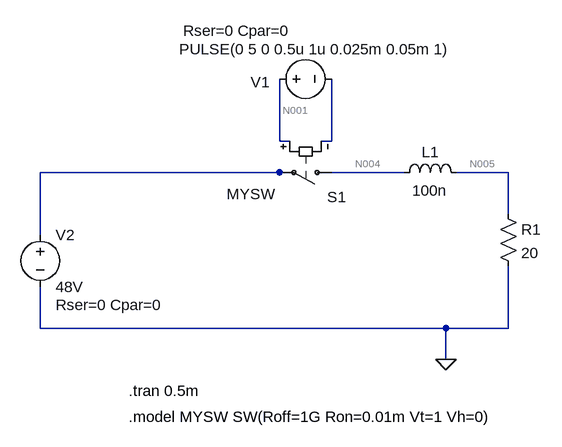
[diagram p0: schematic sim_caps.asc]
sim_caps.asc, the LTspice schematic file:
Version 4
SHEET 1 1212 680
WIRE 128 176 128 80
WIRE 144 176 128 176
WIRE 208 176 208 80
WIRE 208 176 192 176
WIRE 128 224 -240 224
WIRE 144 224 128 224
WIRE 320 224 208 224
WIRE 480 224 400 224
WIRE 480 288 480 224
WIRE -240 320 -240 224
WIRE -240 464 -240 400
WIRE 384 464 -240 464
WIRE 480 464 480 368
WIRE 480 464 384 464
WIRE 384 512 384 464
FLAG 384 512 0
SYMBOL ind 304 240 R270
WINDOW 0 32 56 VTop 2
WINDOW 3 4 55 VBottom 2
SYMATTR InstName L1
SYMATTR Value 100n
SYMBOL res 464 272 R0
SYMATTR InstName R1
SYMATTR Value 20
SYMBOL voltage -240 304 R0
WINDOW 123 0 0 Left 2
WINDOW 39 24 124 Left 2
SYMATTR SpiceLine Rser=0 Cpar=0
SYMATTR InstName V2
SYMATTR Value 48V
SYMBOL sw 224 224 R90
WINDOW 0 38 -7 VRight 2
WINDOW 3 33 103 VRight 2
SYMATTR InstName S1
SYMATTR Value MYSW
SYMBOL voltage 112 80 R270
WINDOW 123 0 0 Left 2
WINDOW 39 74 -132 VRight 2
WINDOW 0 -5 -28 VRight 2
WINDOW 3 46 -138 VRight 2
SYMATTR SpiceLine Rser=0 Cpar=0
SYMATTR InstName V1
SYMATTR Value PULSE(0 5 0 0.5u 1u 0.025m 0.05m 1)
TEXT -104 560 Left 2 !.tran 0.5m
TEXT -104 600 Left 2 !.model MYSW SW(Roff=1G Ron=0.01m Vt=1 Vh=0)

The netlist it stands for:
* sim_caps.asc
L1 N004 N005 100n
R1 N005 0 20
V2 N003 0 48V Rser=0 Cpar=0
S1 N004 N003 N001 N002 MYSW
V1 N001 N002 PULSE(0 5 0 0.5u 1u 0.025m 0.05m 1) Rser=0 Cpar=0
.tran 0.5m
.model MYSW SW(Roff=1G Ron=0.01m Vt=1 Vh=0)
.backanno
.end

* Results of the author's LTspice run, read from the files saved beside the schematic
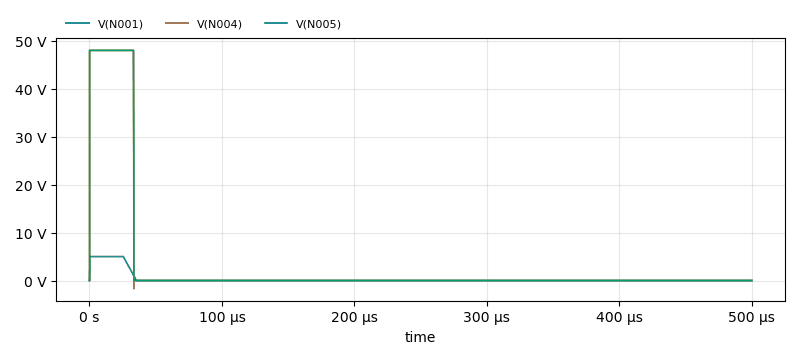
[diagram p1: Transient Analysis of sim_caps.asc, plotted from the saved traces]
* Transient Analysis, 1 run:
*   V(N001): min 0 V, max 5 V, average 302.5 mV, rms 1.21 V, last 0 V
*   V(N004): min -1.724 V, max 48 V, average 3.197 V, rms 12.38 V, last 0 V
*   V(N005): min 0 V, max 48 V, average 3.198 V, rms 12.38 V, last 0 V